# Altium schematic sheet Э3А3.SchDoc
size 420 x 297 mm; SheetNumber: 4; SheetTotal: 4; Scale: 1:1
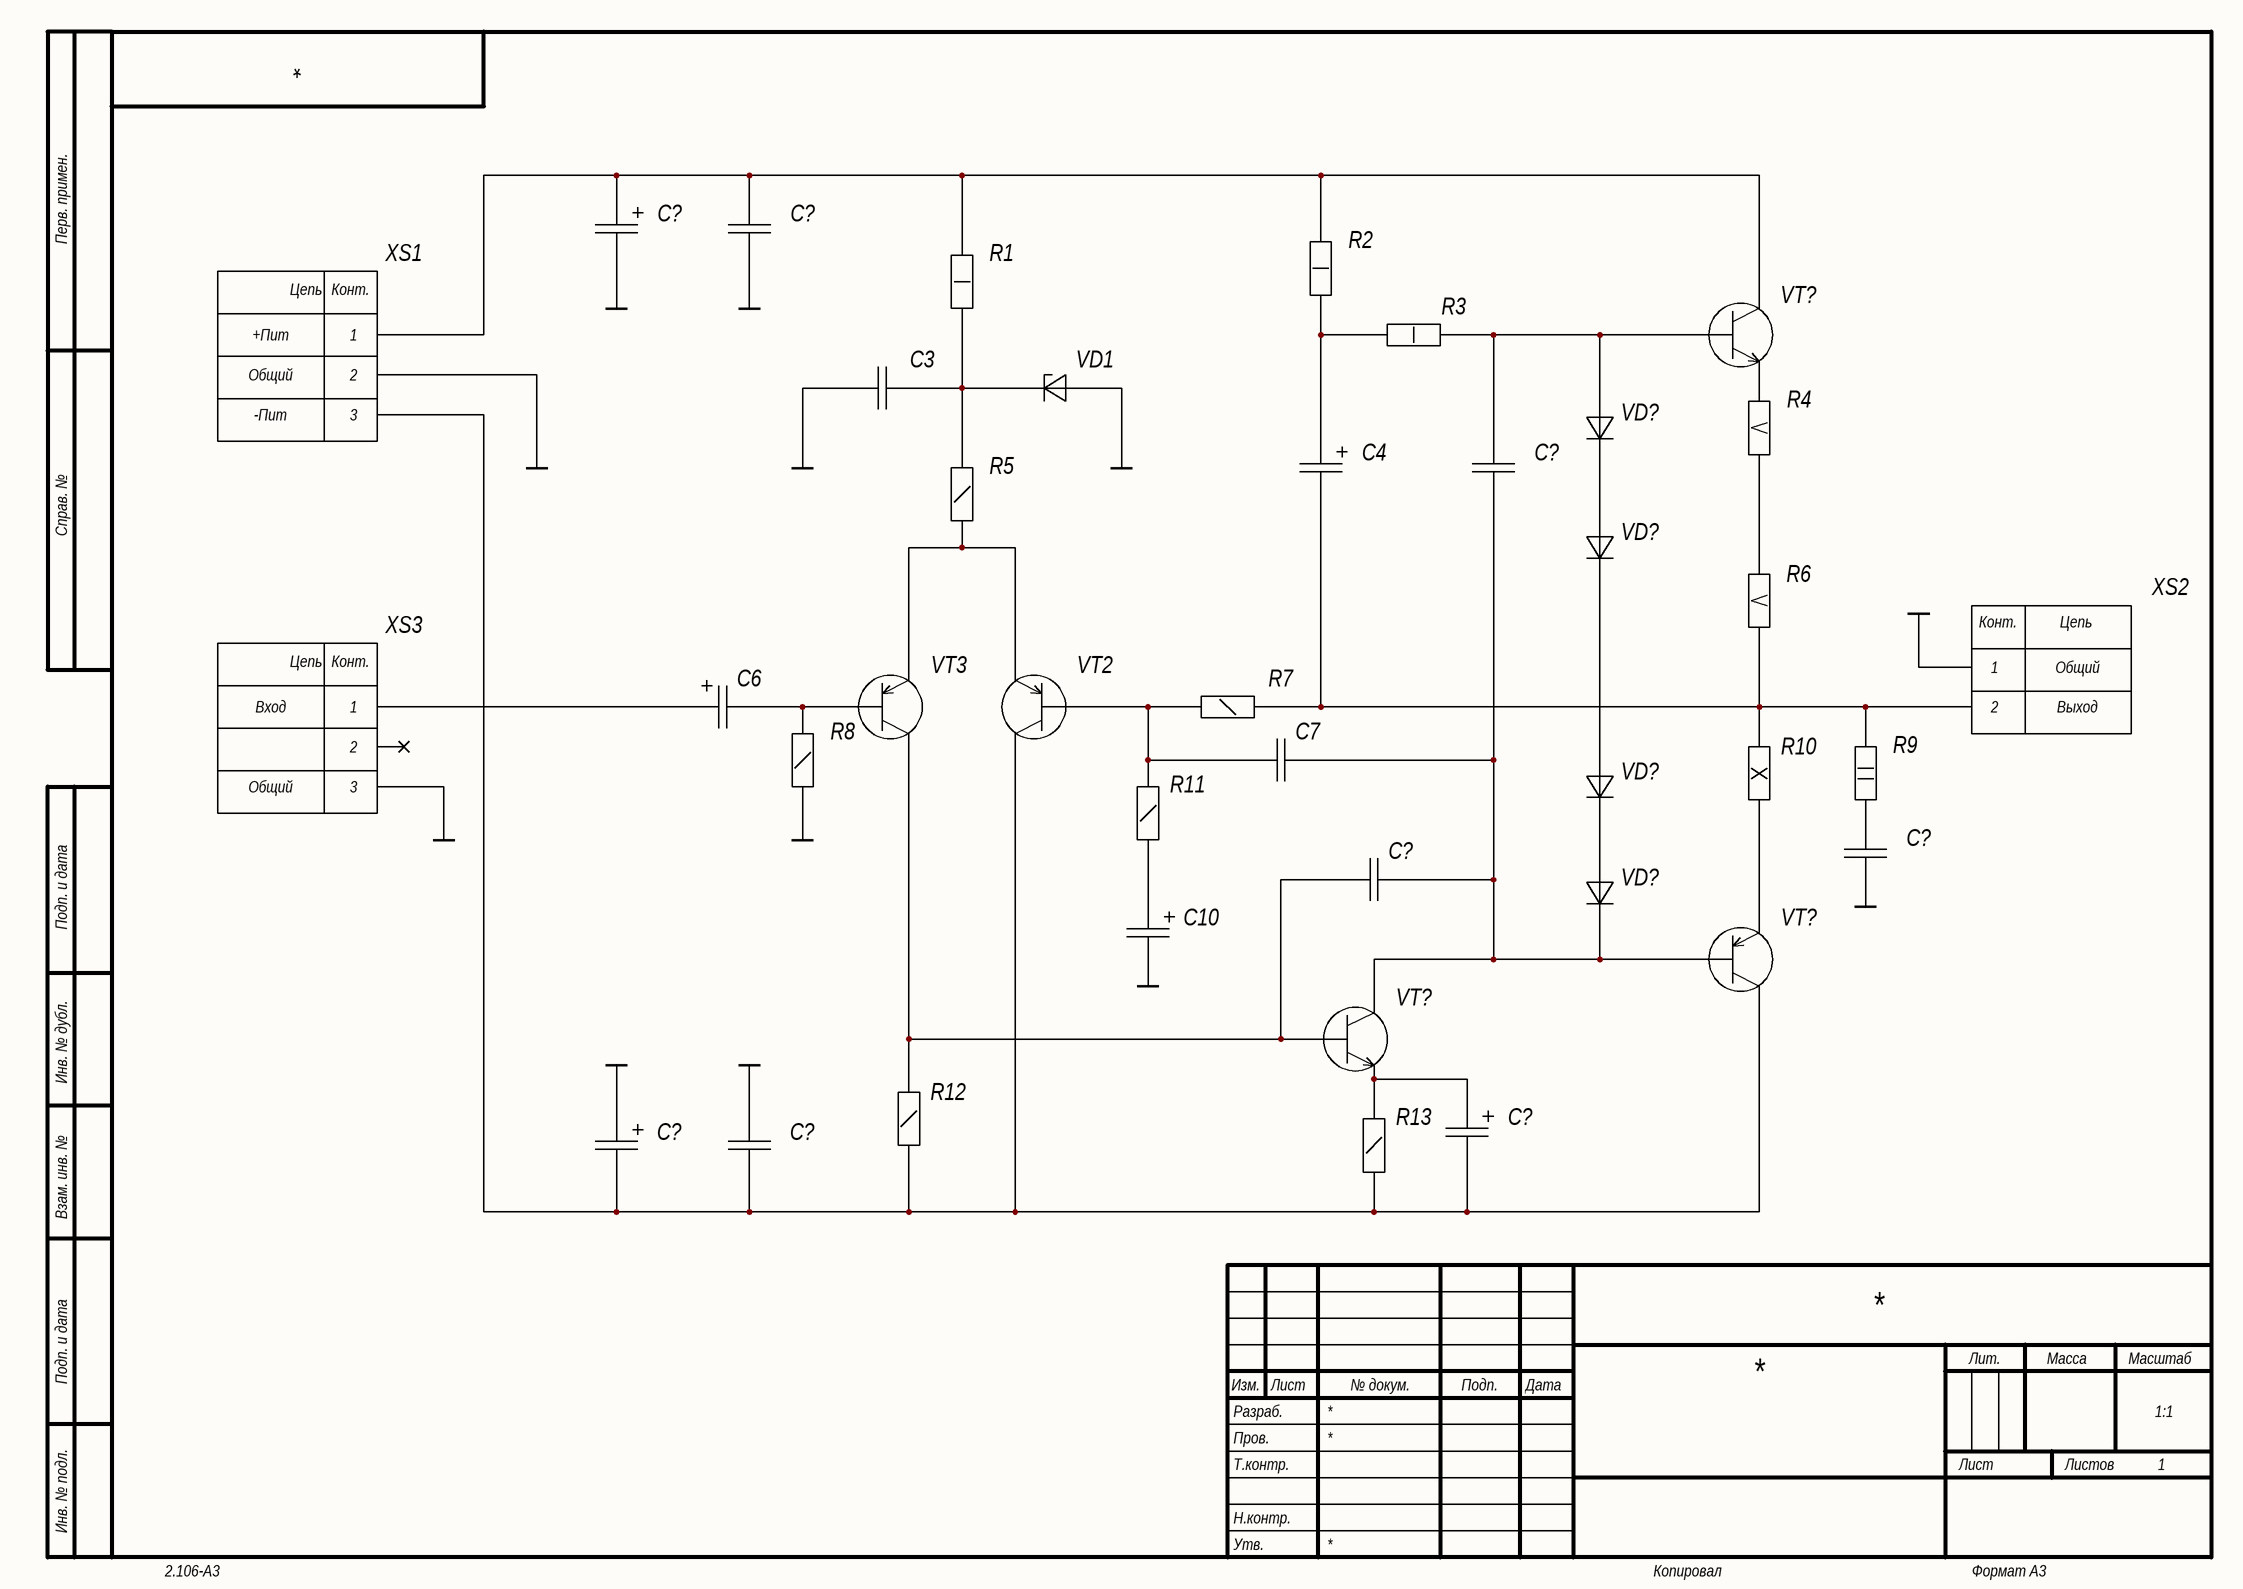
[diagram p0: Э3А3.SchDoc]

## Parts
(Parts that share a designator on the sheet are numbered #1, #2 ... from top to bottom, then left to right.)
C3  220nF  [Cap 220nF]  (value not drawn)
C4  220uF/50V  [Cap 220U/100V]  (value not drawn)
C6  10uF/25V  [Cap 10u/25V]  (value not drawn)
C7  220pF  [Cap 220p]  (value not drawn)
C10  470uF/10V  [Cap 470u/10V]  (value not drawn)
C?#1  220uF/100V  [Cap 220U/100V]  (value not drawn)
C?#2  1uF/63V  [Cap 1u/63V]  (value not drawn)
C?#3  470nF  [Cap 470n]  (value not drawn)
C?#4  100nF/100V  [Cap 100n/100V]  (value not drawn)
C?#5  100pF/100V  [Cap 100p]  (value not drawn)
C?#6  10uF/25V  [Cap 10u/25V]  (value not drawn)
C?#7  220uF/100V  [Cap 220U/100V]  (value not drawn)
C?#8  1uF/63V  [Cap 1u/63V]  (value not drawn)
R1  Resistor 1W  [Res 1W]  (value not drawn)
R2  Resistor 1W  [Res 1W]  (value not drawn)
R3  Resistor 1W  [Res 1W]  (value not drawn)
R4  Resistor 5W  [Res 5W]  (value not drawn)
R5  Resistor 0.25W  [Res 0.25W]  (value not drawn)
R6  Resistor 5W  [Res 5W]  (value not drawn)
R7  Resistor 0.25W  [Res 0.25W]  (value not drawn)
R8  Resistor 0.25W  [Res 0.25W]  (value not drawn)
R9  Resistor 2W  [Res 2W]  (value not drawn)
R10  Resistor 10W  [Res 10W]  (value not drawn)
R11  Resistor 0.25W  [Res 0.25W]  (value not drawn)
R12  Resistor 0.25W  [Res 0.25W]  (value not drawn)
R13  Resistor 0.25W  [Res 0.25W]  (value not drawn)
VD1  ZPD12  [DO-35]  (value not drawn)
VD?#1  Diode 1N4001  [DO-41]  (value not drawn)
VD?#2  Diode 1N4001  [DO-41]  (value not drawn)
VD?#3  Diode 1N4001  [DO-41]  (value not drawn)
VD?#4  Diode 1N4001  [DO-41]  (value not drawn)
VT2  BC556B  [TO-92-A]  (value not drawn)
VT3  BC556B  [TO-92-A]  (value not drawn)
VT?#1  TIP142  [TO-247]  (value not drawn)
VT?#2  TIP147  [TO-247]  (value not drawn)
VT?#3  BD241C  [TO-220]  (value not drawn)
XS1  Connector 15EDGRC-3.81-03P  [15EDGRC-3.81-03P]  (value not drawn)
XS2  Connector 15EDGRC-3.81-02P  [15EDGRC-3.81-02P]  (value not drawn)
XS3  Connector ST-025  [ST-025]  (value not drawn)

## Nets
GND: C3.2 C10.2 C?#1.2 C?#2.1 C?#4.1 C?#7.1 C?#8.1 R8.1 VD1.1(А) XS1.2 XS2.1 XS3.3
NetC3_1: C3.1 R1.1 R5.2 VD1.2(К)
NetC4_1: C4.1 R2.1 R3.1
NetC4_2: C4.2 R6.2 R7.2 R9.2 R10.2 XS2.2
NetC6_1: C6.1 XS3.1
NetC6_2: C6.2 R8.2 VT3.2(B)
NetC7_1: C7.1 R7.1 R11.2 VT2.2(B)
NetC7_2: C7.2 C?#3.1 C?#5.2 VD?#4.2(К) VT?#2.1(B) VT?#3.2(C)
NetC10_1: C10.1 R11.1
NetC?#1_1: C?#1.1 C?#2.2 R1.2 R2.2 VT?#1.2(C) XS1.1
NetC?#3_2: C?#3.2 R3.2 VD?#1.1(А) VT?#1.1(B)
NetC?#4_2: C?#4.2 R9.1
NetC?#5_1: C?#5.1 R12.2 VT3.1(C) VT?#3.1(B)
NetC?#6_1: C?#6.1 R13.2 VT?#3.3(E)
NetC?#6_2: C?#6.2 C?#7.2 C?#8.2 R12.1 R13.1 VT2.1(C) VT?#2.2(C) XS1.3
NetR4_1: R4.1 VT?#1.3(E)
NetR4_2: R4.2 R6.1
NetR5_1: R5.1 VT2.3(E) VT3.3(E)
NetR10_1: R10.1 VT?#2.3(E)
NetVD?#1_2: VD?#1.2(К) VD?#2.1(А)
NetVD?#2_2: VD?#2.2(К) VD?#3.1(А)
NetVD?#3_2: VD?#3.2(К) VD?#4.1(А)

Not connected (* = marked no-connect by the designer): XS3 2*

## Notes on the sheet
- +Пит
- Общий
- -Пит
- Вход
- Выход
- Перв. примен.
- Справ. №
- Подп. и дата
- Инв. № дубл.
- Взам. инв. №
- Разраб.
- Изм.
- Лист
- № докум.
- Подп.
- Дата
- Лит.
- Масса
- Масштаб
- Пров.
- Т.контр.
- Листов
- 1
- Инв. № подл.
- Утв.
- Н.контр.
- 2.106-A3
- Копировал
- Формат А3
- (in symbol Connector 15EDGRC-3.81-02P) Конт.; Цепь
- (in symbol Connector 15EDGRC-3.81-03P) Цепь; Конт.
- (in symbol Connector ST-025) Цепь; Конт.

## Library data of the parts
C3 = Capacitor 220nF: Type: Конденсатор; Published: 18.05.2010; Publisher: Andrew Danich
C4 = Capacitor 220uF 50V: Type: Конденсатор; Published: 18.05.2010; Publisher: Andrew Danich
C6 C?#6 = Capacitor 10uF 25V: Type: Конденсатор; Published: 18.05.2010; Publisher: Andrew Danich
C7 = Capacitor 220pF: Type: Конденсатор; Published: 18.05.2010; Publisher: Andrew Danich
C10 = Capacitor 470uF 10V: Type: Конденсатор; Published: 18.05.2010; Publisher: Andrew Danich
C?#1 C?#7 = Capacitor 220uF 100V: Type: Конденсатор; Published: 18.05.2010; Publisher: Andrew Danich
C?#2 C?#8 = Capacitor 1uF 63V: Type: Конденсатор; Published: 18.05.2010; Publisher: Andrew Danich
C?#3 = Capacitor 470nF: Type: Конденсатор; Published: 18.05.2010; Publisher: Andrew Danich
C?#4 = Capacitor 100nF 100V: Type: Конденсатор; Published: 18.05.2010; Publisher: Andrew Danich
C?#5 = Capacitor 100pF 100V: Type: Конденсатор; Published: 18.05.2010; Publisher: Andrew Danich
VD1 = ZPD12: Type: Стабилитрон; Published: 20.05.2013; Publisher: Andrew Danich
VD?#1-VD?#4 = Diode 1N4001: Type: Диод; Published: 18.05.2010; Publisher: Andrew Danich
R1-R3 = Resistor 1W: Published: 24.03.2010; Publisher: Andrew Danich; Type: Резистор
R4 R6 = Resistor 5W: Published: 24.03.2010; Publisher: Andrew Danich; Type: Резистор
R5 R7 R8 R11-R13 = Resistor 0.25W: Published: 24.03.2010; Publisher: Andrew Danich; Type: Резистор
R9 = Resistor 2W: Published: 24.03.2010; Publisher: Andrew Danich; Type: Резистор
R10 = Resistor 10W: Published: 24.03.2010; Publisher: Andrew Danich; Type: Резистор